# Altium schematic sheet Memoria_I2C.SchDoc: Memoria I2C
size A4; Autor: Eugenia Ipar; Author: **; CompanyName: Introducción al Diseño de Circuitos Impresos; Organization: UTN FRBA; DocumentNumber: 5; Revision: 01; SheetNumber: 5; SheetTotal: 9
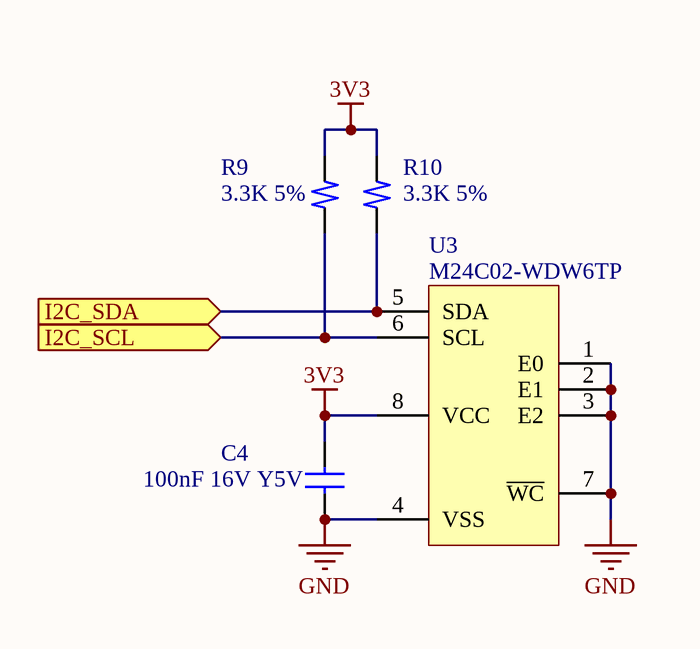
[diagram p0: Memoria_I2C.SchDoc]

## Parts
C4  100nF 16V Y5V  [C_0402]
R9  3.3K 5%  [R_0402]
R10  3.3K 5%  [R_0402]
U3  M24C02-WDW6TP  [TSSOP-8]

## Ports
I2C_SCL (in), I2C_SDA (in)

## Nets
3V3: C4.1 R9.2 R10.2 U3.8(VCC)
GND: C4.2 U3.1(E0) U3.2(E1) U3.3(E2) U3.4(VSS) U3.7(~{WC})
I2C_SCL: R9.1 U3.6(SCL) ; port I2C_SCL
I2C_SDA: R10.1 U3.5(SDA) ; port I2C_SDA

## Notes on the sheet
- Title:
- Size:
- Author:
- A4
- Sheet
- of
- Revision:
- File:
- Date:

## Library data of the parts
C4 = Ceramic Capacitor: Ceramic Capacitor SMD 0402
R9 R10 = Resistor: Resistor SMD 0402
U3 = EEPROM M24C02-WDW6TP: M24C02-WDW6TP 2.5-5V 2Kbit Serial I2C Bus EEPROM